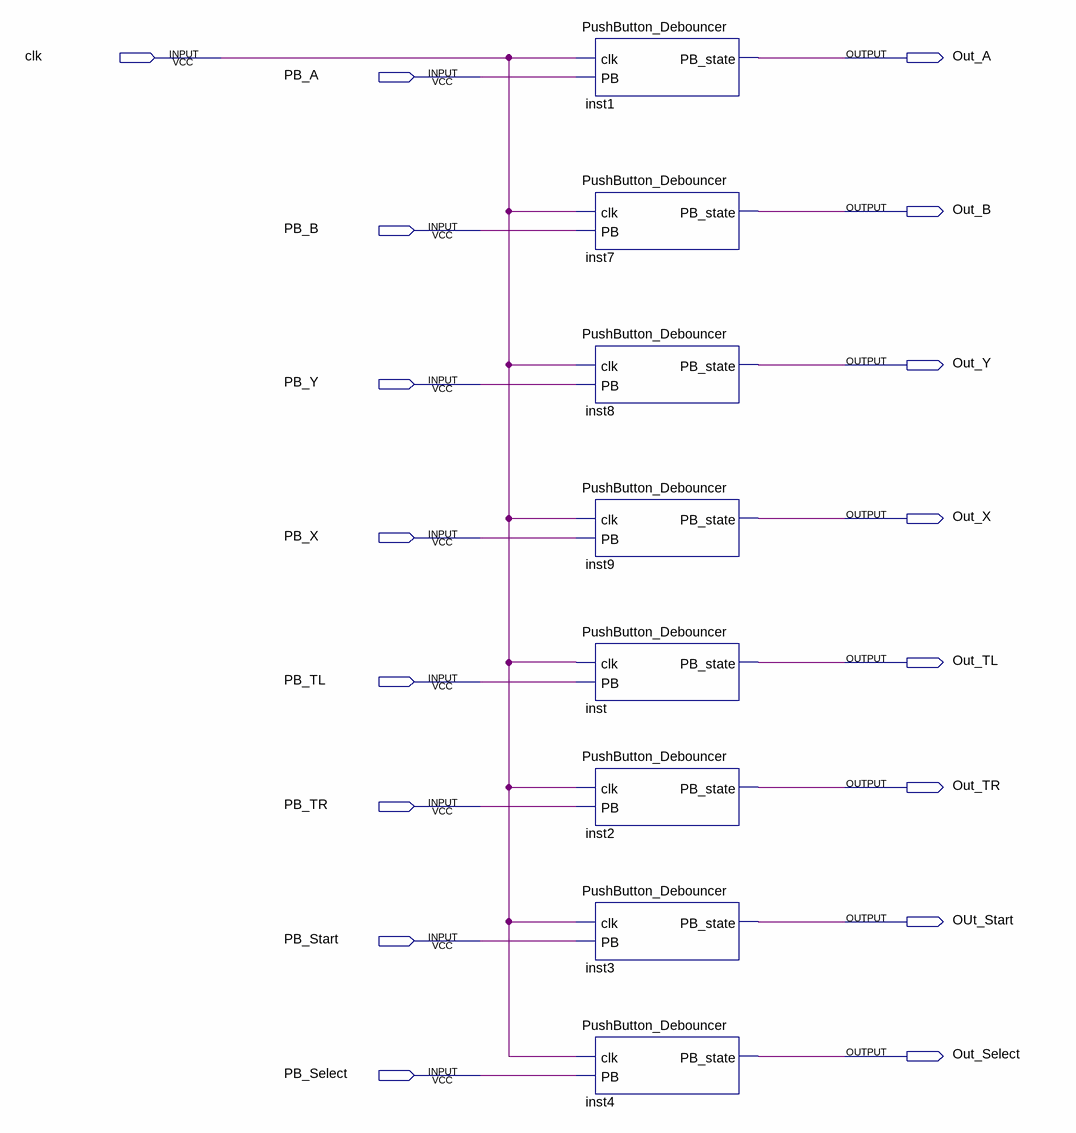
[diagram p0: schematic sheet]
// Quartus schematic debounce_block.bdf as structural Verilog: 8 symbols, 17 pins
module debounce_block (
  input  clk,
  input  PB_A,
  input  PB_B,
  input  PB_Y,
  input  PB_X,
  input  PB_TL,
  input  PB_TR,
  input  PB_Start,
  input  PB_Select,
  output Out_A,
  output Out_B,
  output Out_Y,
  output Out_X,
  output Out_TL,
  output Out_TR,
  output OUt_Start,
  output Out_Select
);

  PushButton_Debouncer inst1 (.clk(clk), .PB(PB_A), .PB_state(Out_A));
  PushButton_Debouncer inst7 (.clk(clk), .PB(PB_B), .PB_state(Out_B));
  PushButton_Debouncer inst8 (.clk(clk), .PB(PB_Y), .PB_state(Out_Y));
  PushButton_Debouncer inst9 (.clk(clk), .PB(PB_X), .PB_state(Out_X));
  PushButton_Debouncer inst (.clk(clk), .PB(PB_TL), .PB_state(Out_TL));
  PushButton_Debouncer inst2 (.clk(clk), .PB(PB_TR), .PB_state(Out_TR));
  PushButton_Debouncer inst3 (.clk(clk), .PB(PB_Start), .PB_state(OUt_Start));
  PushButton_Debouncer inst4 (.clk(clk), .PB(PB_Select), .PB_state(Out_Select));
endmodule
